# EAGLE schematic SVD01 (EAGLE 4.09)
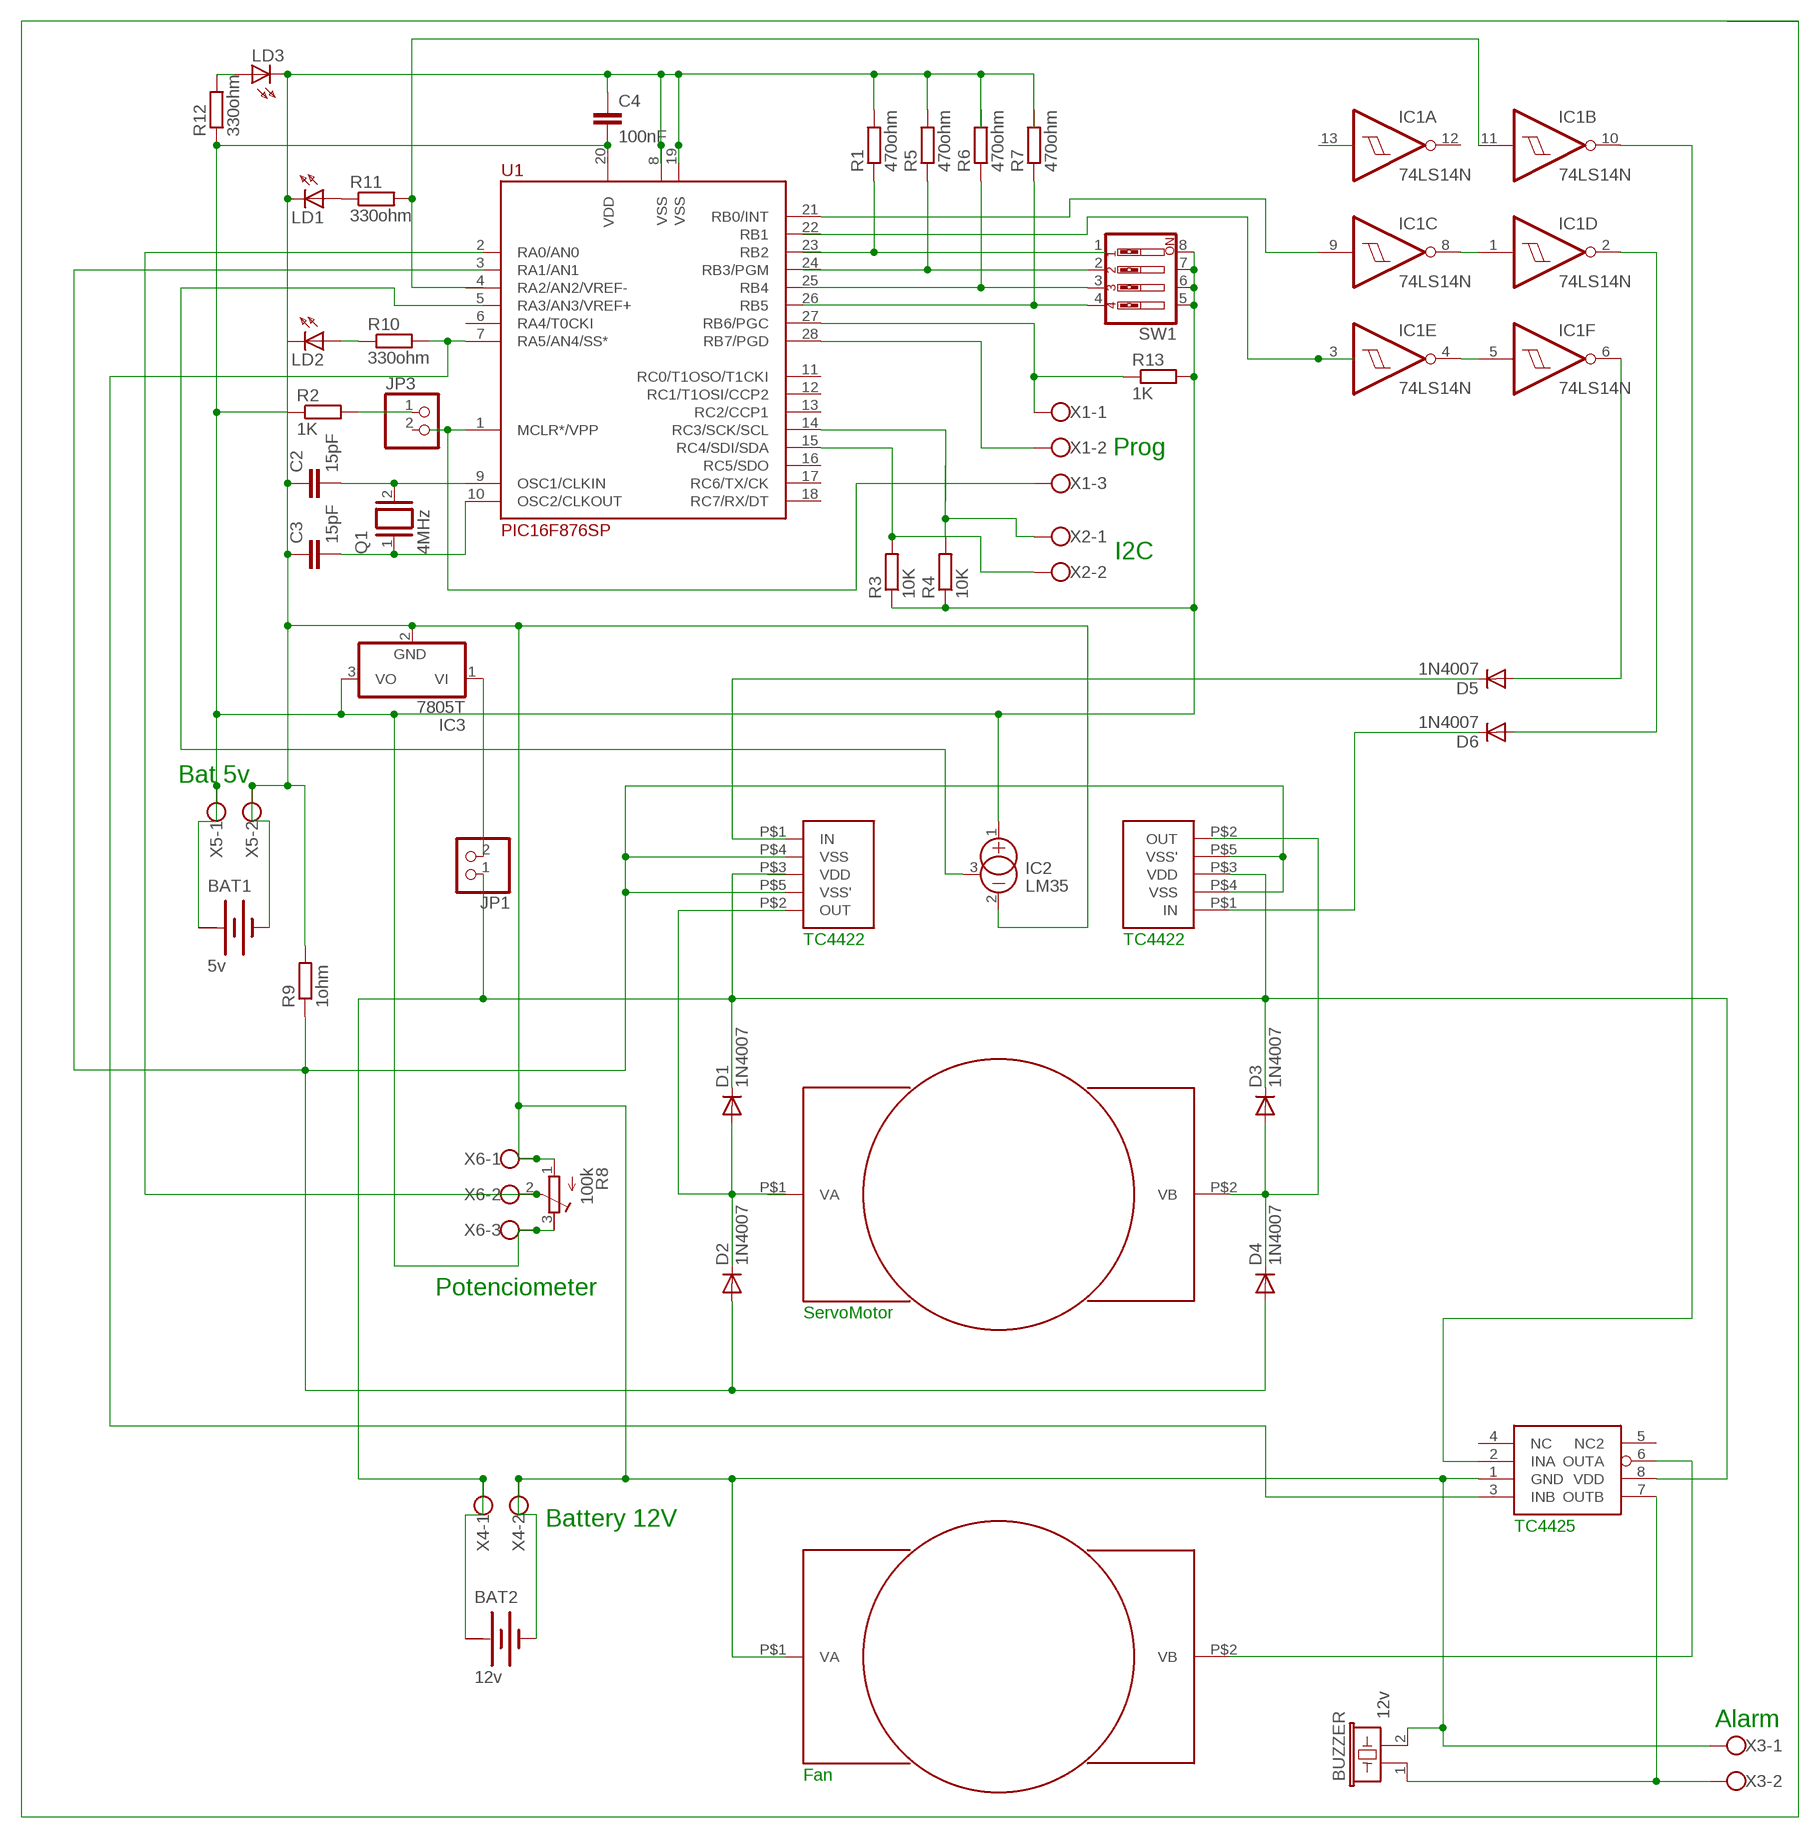
[diagram p0: schematic, sheet 1]

## Parts
BAT1  5v  BATTERY  [BATTERY]
BAT2  12v  BATTERY  [BATTERY]
BUZZER  12v  B/C17L  [B/C17L]
C2  15pF  C-EU050-024X044  [C050-024X044]
C3  15pF  C-EU050-024X044  [C050-024X044]
C4  100nF  C2,5-3  [C2.5-3]
D1  1N4007  1N4004  [DO41-10]
D2  1N4007  1N4004  [DO41-10]
D3  1N4007  1N4004  [DO41-10]
D4  1N4007  1N4004  [DO41-10]
D5  1N4007  1N4004  [DO41-10]
D6  1N4007  1N4004  [DO41-10]
IC1  74LS14N  [DIL14]
IC2  LM35  AD590ZR  [TO92]
IC3  7805T  [TO220H]
JP1  PINHD-1X2  [1X02]
JP3  PINHD-1X2  [1X02]
LD1  LED5MM  [LED5MM]
LD2  LED5MM  [LED5MM]
LD3  LED3MM  [LED3MM]
MOTOR  MOTOR  [MOTOR]
Q1  4MHz  XTAL/S  [QS]
R1  470ohm  R-EU_0207/10  [0207/10]
R2  1K  R-EU_0204/7  [0204/7]
R3  10K  R-EU_0411/3V  [0411V]
R4  10K  R-EU_0411/3V  [0411V]
R5  470ohm  R-EU_0207/10  [0207/10]
R6  470ohm  R-EU_0207/10  [0207/10]
R7  470ohm  R-EU_0207/10  [0207/10]
R8  100k  R-TRIMM4G/J  [RTRIM4G/J]
R9  1ohm  R-EU_0922/22  [0922/22]
R10  330ohm  R-EU_0207/7  [0207/7]
R11  330ohm  R-EU_0207/7  [0207/7]
R12  330ohm  R-EU_0204/7  [0204/7]
R13  1K  R-EU_0207/10  [0207/10]
SW1  SW_DIP-4  [EDG-04]
U1  PIC16F876SP  [DIL28-3]
U$1  TC4422  [TC4422]
U$2  TC4422  [TC4422]
U$3  TC4425  [DIL08]
U$4  MOTOR  [MOTOR]
X1  AK300/3  [AK300/3]
X2  AK300/2  [AK300/2]
X3  AK300/2  [AK300/2]
X4  AK300/2  [AK300/2]
X5  AK300/2  [AK300/2]
X6  AK300/3  [AK300/3]

## Nets
N$1: U1.14(RC3/SCK/SCL)
N$2: R1.1 SW1.1 U1.23(RB2)
N$3: R5.1 SW1.2 U1.24(RB3/PGM)
N$4: R6.1 SW1.3 U1.25(RB4)
N$5: R7.1 SW1.4 U1.26(RB5)
N$6: BUZZER.1 U$3.7(OUTB) X3.2
N$7: IC1.1(D:I) IC1.8(C:O)
N$8: IC1.4(E:O) IC1.5(F:I)
N$9: IC1.3(E:I)
N$10: IC1.9(C:I) U1.21(RB0/INT)
N$11: D1.A D2.C
N$12: D3.A D4.C MOTOR.P$2(VB)
N$13: R8.2(S) X6.2
N$14: R10.2 U1.7(RA5/AN4/SS*) U$3.3(INB)
N$15: D2.A D4.A R9.1 U$2.P$4(VSS) U$2.P$5(VSS')
N$17: IC1.13(A:I)
N$18: LD1.A R11.1
N$19: LD2.A R10.1
N$20: C2.2 Q1.2 U1.9(OSC1/CLKIN)
N$21: U1.1(MCLR*/VPP) X1.3
N$24: D5.A IC1.6(F:O)
N$25: C3.2 Q1.1 U1.10(OSC2/CLKOUT)
N$26: IC2.3(CAN)
N$27: D6.A IC1.2(D:O)
N$28: D6.C U$2.P$1(IN)
N$29: D5.C
N$30: U$3.6(OUTA) U$4.P$2(VB)
N$31: R13.1 U1.27(RB6/PGC) X1.1
N$32: IC1.10(B:O) U$3.2(INA)
N$33: LD3.A R12.2
N$34: IC3.1(VI) JP1.2
N$35: JP3.1 R2.2
N$36: U1.28(RB7/PGD) X1.2
N$37: IC1.11(B:I) R11.2
N$38: BAT2.+ D1.C D3.C JP1.1 U$2.P$3(VDD) U$3.8(VDD) X4.1
N$39: R3.2 U1.15(RC4/SDI/SDA) X2.2
N$40: BAT1.+ C4.2 IC2.1(+) IC3.3(VO) R2.1 R3.1 R4.1 R8.3(A) R12.1 R13.2 SW1.5 SW1.6 SW1.7 SW1.8 U1.20(VDD) X5.1 X6.3
N$41: R4.2 X2.1
VSS2: BAT1.- BAT2.- BUZZER.2 C2.1 C3.1 C4.1 IC2.2(-) IC3.2(GND) LD1.K(C) LD2.K(C) LD3.K(C) R1.2 R5.2 R8.1(E) R9.2 U1.8(VSS1) U1.19(VSS2) U$3.1(GND) X3.1 X4.2 X5.2 X6.1
Unconnected: IC1.12(A:O) JP3.2 MOTOR.P$1(VA) R6.2 R7.2 U1.2(RA0/AN0) U1.3(RA1/AN1) U1.4(RA2/AN2/VREF-) U1.5(RA3/AN3/VREF+) U1.6(RA4/T0CKI) U1.11(RC0/T1OSO/T1CKI) U1.12(RC1/T1OSI/CCP2) U1.13(RC2/CCP1) U1.16(RC5/SDO) U1.17(RC6/TX/CK) U1.18(RC7/RX/DT) U1.22(RB1) U$1.P$1(IN) U$1.P$2(OUT) U$1.P$3(VDD) U$1.P$4(VSS) U$1.P$5(VSS') U$2.P$2(OUT) U$3.4(NC) U$3.5(NC2) U$4.P$1(VA)

## Notes on the sheet
- Prog
- I2C
- Bat 5v
- TC4422 | TC4422
- Potenciometer
- ServoMotor
- Battery 12V
- TC4425
- Alarm
- Fan

## Power pins joined to a net without a drawn wire
+: BAT1.+@1(+) BAT2.+@1(+)
GND: IC1.7(P:GND)
VCC: IC1.14(P:VCC)

## Library data of the parts
BAT1 BAT2 = special:BATTERY: BATTERY
BUZZER = buzzer:B/C17L: BUZZER Source: Buerklin
C2 C3 = rcl:C-EU: CAPACITOR, European symbol
C4 = capacitor-wima:C: CAPACITOR naming: grid - package width
D1-D6 = diode:1N4004: DIODE general purpose rectifier, 1 A
IC1 = 74xx-eu:74*14: Hex schmitt trigger INVERTER
IC2 = linear:AD590ZR: TEMPERATURE SENSOR current output
IC3 = linear:78*: Positive VOLTAGE REGULATOR
JP1 JP3 = pinhead:PINHD-1X2: PIN HEADER
LD1-LD3 = led:LED: LED
MOTOR U$4 = Otros:MOTOR: Electric Motor
Q1 = special:XTAL/S: CRYSTAL
R1-R7 R9-R13 = rcl:R-EU_: RESISTOR, European symbol
R8 = rcl:R-TRIMM: Trimm resistor
SW1 = special:SW_DIP-4: DIP SWITCH
U1 = pic16f87x:PIC16F876: FLASH MICROCONTROLLER
U$1 U$2 = Otros:TC4422: TC4422 Driver 9A
U$3 = Otros:TC4425: TC4425 Dual Driver
X1 X6 = con-ptr500:AK300/3: CONNECTOR
X2-X5 = con-ptr500:AK300/2: CONNECTOR